# EAGLE schematic Powerbox (EAGLE 9.6.2)
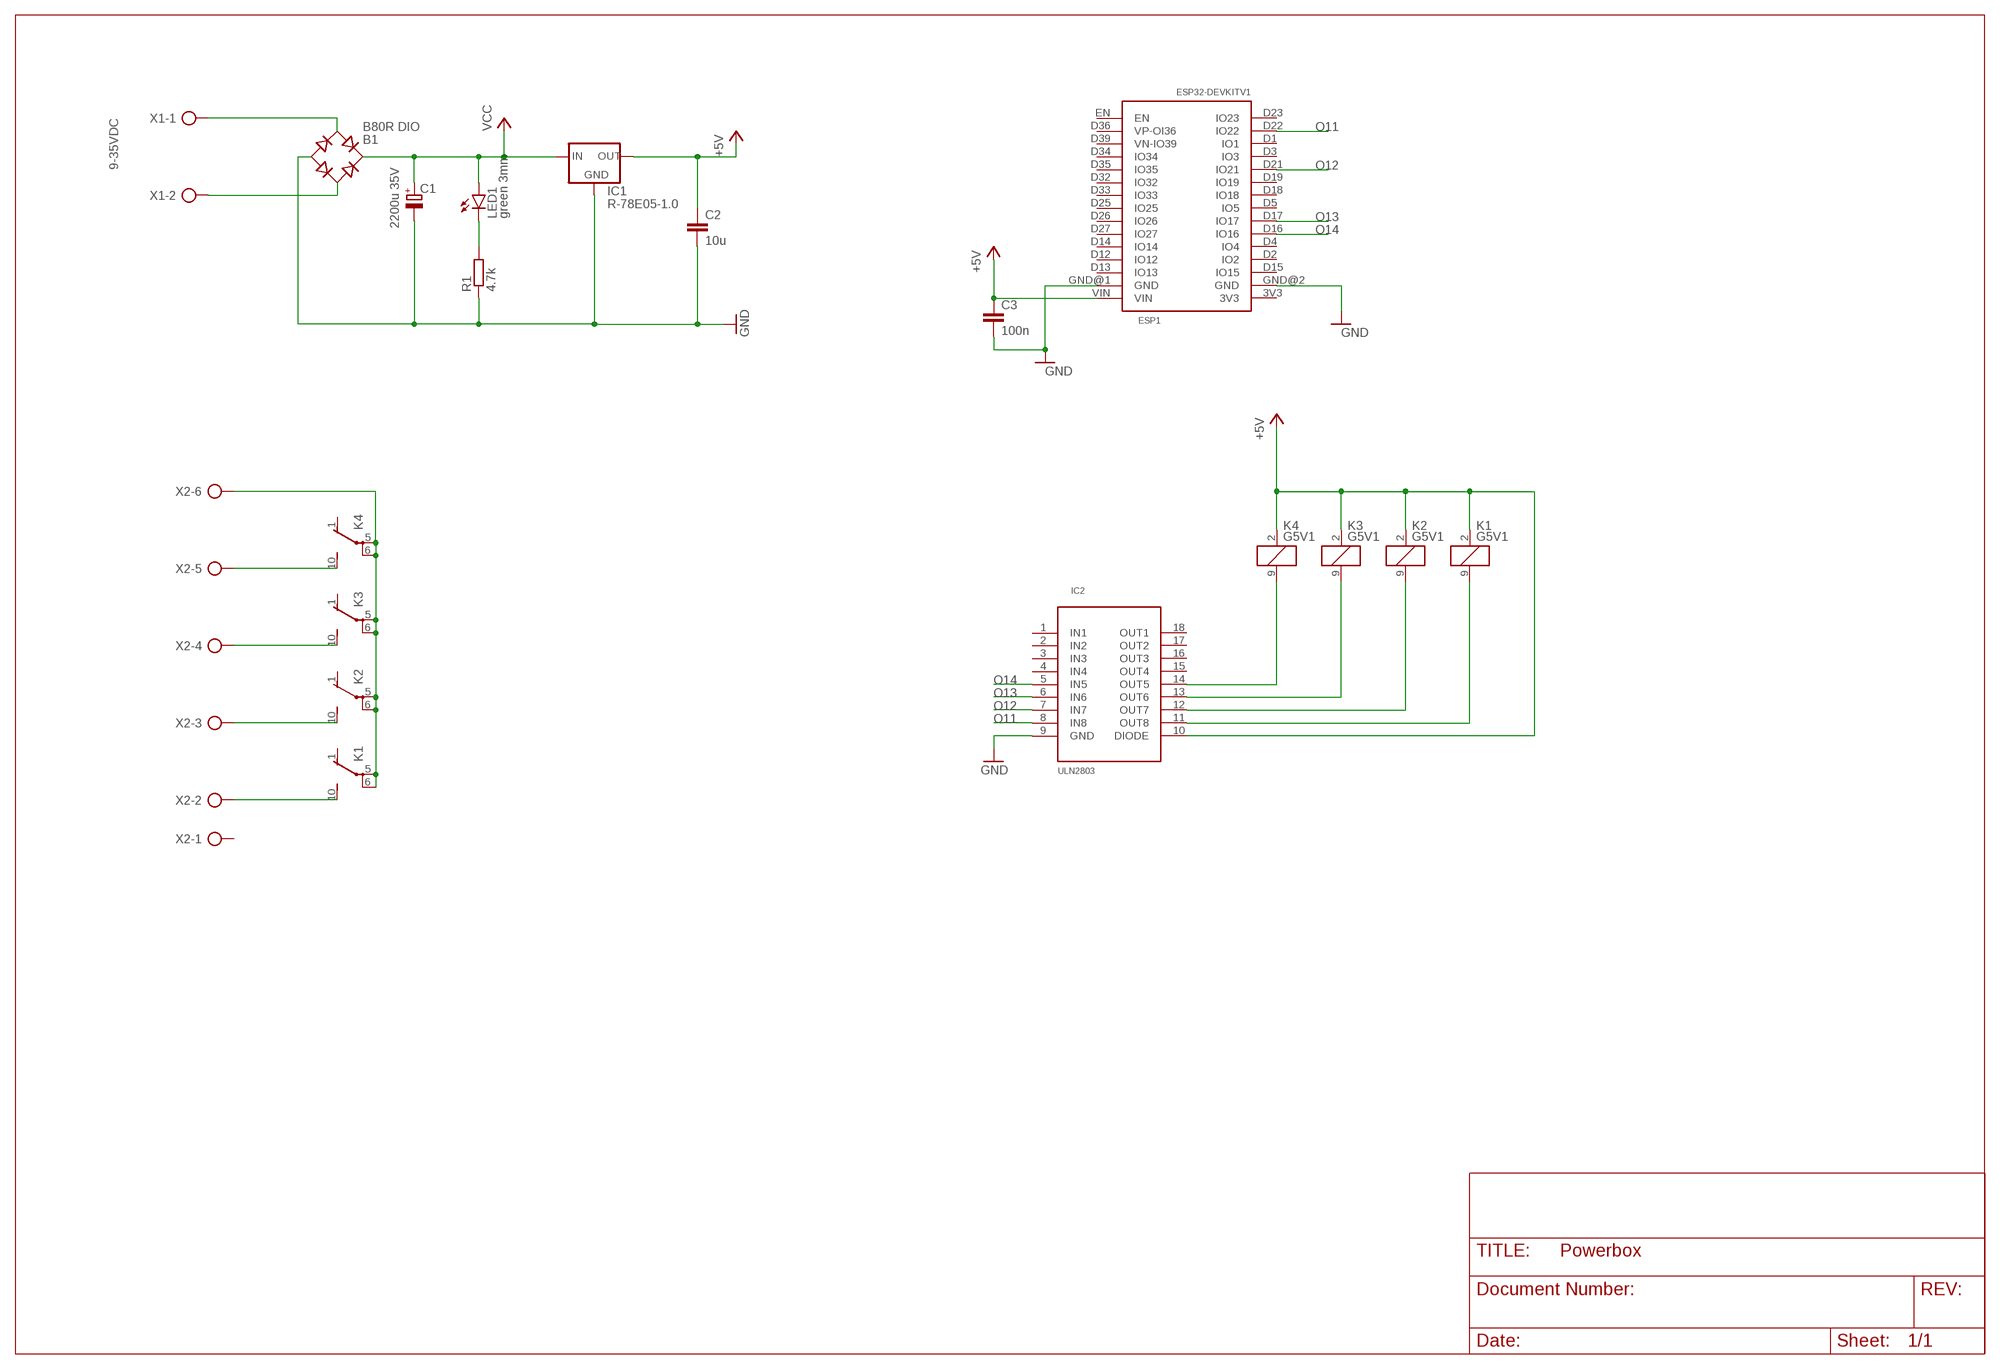
[diagram p0: schematic, sheet 1]

## Parts
B1  B80R DIO  RB1A  [RB1A]
C1  2200u 35V  CPOL-EUE5-8.5  [E5-8,5]
C2  10u  C-EU050-024X044  [C050-024X044]
C3  100n  C-EU050-024X044  [C050-024X044]
ESP1  ESP32DEVKITV1  [ESP32-DEVKITV1]
IC1  R-78E05-1.0  R-78E-XX1.0  [R-78E-XX1.0]
IC2  ULN2803  ULN2803DIL18  [DIL18]
K1  G5V1  [G5V1]
K2  G5V1  [G5V1]
K3  G5V1  [G5V1]
K4  G5V1  [G5V1]
LED1  green 3mm  TLLG4400  [LED3MM]
R1  4.7k  R-EU_0207/10  [0207/10]
X1  AK500/2  [AK500/2]
X2  AK500/6  [AK500/6]

## Nets
+5V: C2.1 C3.1 ESP1.VIN IC1.OUT IC2.10(DIODE) K1.2 K2.2 K3.2 K4.2
GND: B1.- C1.- C2.2 C3.2 ESP1.GND@1(GND) ESP1.GND@2(GND) IC1.GND IC2.9(GND) R1.1
N$1: IC2.11(OUT8) K1.9
N$2: IC2.12(OUT7) K2.9
N$3: LED1.K(C) R1.2
N$4: IC2.13(OUT6) K3.9
N$5: B1.AC1 X1.1
N$6: B1.AC2 X1.2
N$7: IC2.14(OUT5) K4.9
N$8: K1.5(2:P) K1.6(2:P) K2.5(2:P) K2.6(2:P) K3.5(2:P) K3.6(2:P) K4.5(2:P) K4.6(2:P) X2.6
N$9: K4.10(2:S) X2.5
N$10: K3.10(2:S) X2.4
N$11: K2.10(2:S) X2.3
N$12: K1.10(2:S) X2.2
O11: ESP1.D22(IO22) IC2.8(IN8)
O12: ESP1.D21(IO21) IC2.7(IN7)
O13: ESP1.D17(IO17) IC2.6(IN6)
O14: ESP1.D16(IO16) IC2.5(IN5)
VCC: B1.+ C1.+ IC1.IN LED1.A
Unconnected: ESP1.D1(IO1) ESP1.D2(IO2) ESP1.D3(IO3) ESP1.D4(IO4) ESP1.D5(IO5) ESP1.D12(IO12) ESP1.D13(IO13) ESP1.D14(IO14) ESP1.D15(IO15) ESP1.D18(IO18) ESP1.D19(IO19) ESP1.D23(IO23) ESP1.D25(IO25) ESP1.D26(IO26) ESP1.D27(IO27) ESP1.D32(IO32) ESP1.D33(IO33) ESP1.D34(IO34) ESP1.D35(IO35) ESP1.D36(VP-OI36) ESP1.D39(VN-IO39) ESP1.EN IC2.1(IN1) IC2.2(IN2) IC2.3(IN3) IC2.4(IN4) IC2.15(OUT4) IC2.16(OUT3) IC2.17(OUT2) IC2.18(OUT1) K1.1(2:O) K2.1(2:O) K3.1(2:O) K4.1(2:O) X2.1

## Notes on the sheet
- 9-35VDC

## Power pins joined to a net without a drawn wire
3V3: ESP1.3V3

## Library data of the parts
B1 = rectifier:RB1A: RECTIFIER 1 A
C1 = rcl:CPOL-EU: POLARIZED CAPACITOR, European symbol; SPICEPREFIX: C
C2 C3 = rcl:C-EU: CAPACITOR, European symbol; SPICEPREFIX: C
ESP1 = _esp32:ESP32DEVKITV1
IC1 = _eigene:R-78E-XX1.0: VOLTAGE REGULATOR
IC2 = _eigene:ULN2803
K1-K4 = relay:G5V1: RELAY 1 x switch, 0.5 A/125 V AC, 1 A/24 V DC , Omron; MPN: G5V-1-DC24; OC_FARNELL: 9949593; OC_NEWARK: 36M6377
LED1 = led:TLLG4400: Low Current (2mA) LED 3 mm Tinted Diffused Package color GREEN Source: Data sheet <http://www.farnell.com/datasheets/391098.pdf>; MF: VISHAY SEMICONDUCTOR; OC_FARNELL: 1612435
R1 = rcl:R-EU_: RESISTOR, European symbol; SPICEPREFIX: R
X1 = con-ptr500:AK500/2: CONNECTOR; OC_FARNELL: unknown; OC_NEWARK: unknown
X2 = con-ptr500:AK500/6: CONNECTOR; OC_FARNELL: unknown; OC_NEWARK: unknown